# EAGLE design HB-UNI-Sen-RFID-RC_V1.0 (EAGLE 9.4.2)
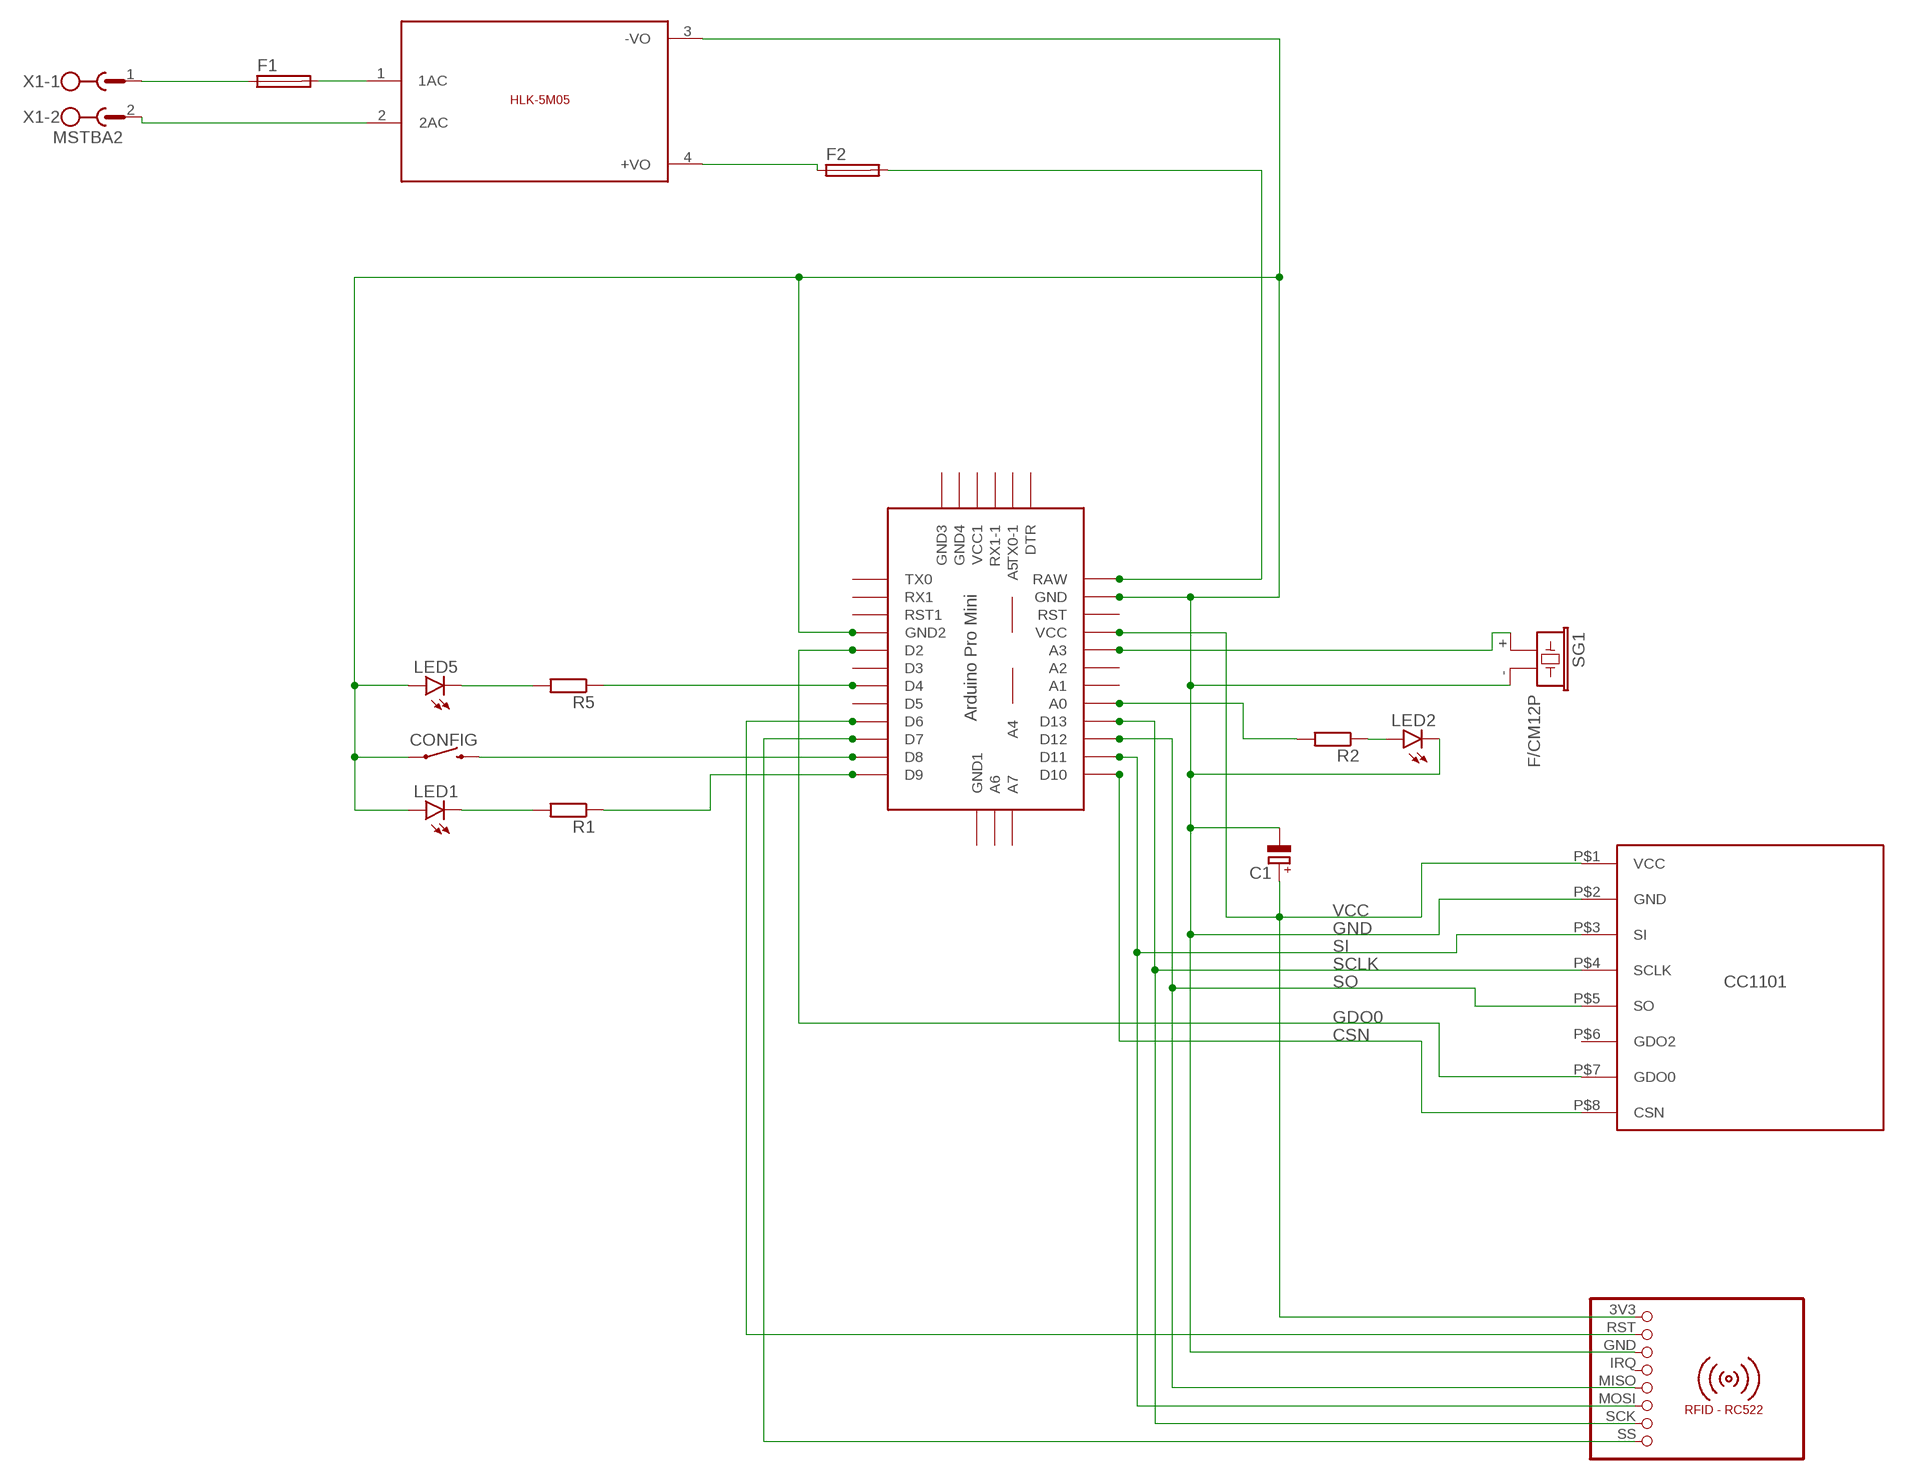
[diagram p0: schematic, sheet 1]

## Parts
C1  CPOL-EUE2.5-5  [E2,5-5]
CONFIG  MOMENTARY-SWITCH-SPST-PTH-6.0MM-KIT  [TACTILE_SWITCH_PTH_6.0MM_KIT]
F1  SH22,5A  [SH22,5A]
F2  SH22,5A  [SH22,5A]
LED1  LED3MM  [LED3MM]
LED2  LED3MM  [LED3MM]
LED5  LED3MM  [LED3MM]
M1  RFID-RC522  [RFID-RC522]
R1  R-EU_0309/10  [0309/10]
R2  R-EU_0309/10  [0309/10]
R5  R-EU_0309/10  [0309/10]
SG1  F/CM12P  [F/CM12P]
U$1  CC1101  [CC1101]
U$2  ABK-PRO-MINI  [ABK-PRO-MINI]
U$3  5VDC/5W  HLK-5M05  [HLK-5M05]
X1  MSTBA2  [MSTBA2]

## Nets
CSN: U$1.P$8(CSN) U$2.D10
GDO0: U$1.P$7(GDO0) U$2.D2
GND: C1.- CONFIG.1 LED1.A LED2.K(C) LED5.A M1.GND SG1.- U$1.P$2(GND) U$2.GND U$2.GND1(GND2) U$3.3(-VO)
N$1: M1.SS U$2.D7
N$2: M1.RST U$2.D6
N$3: LED1.K(C) R1.2
N$4: R1.1 U$2.D9
N$5: SG1.+ U$2.A3
N$7: LED2.A R2.1
N$8: R2.2 U$2.A0
N$9: F1.1 X1.1
N$10: F2.1 U$3.4(+VO)
N$11: U$3.2(2AC) X1.2
N$16: CONFIG.3 U$2.D8
N$17: R5.1 U$2.D4
N$18: LED5.K(C) R5.2
N$19: F1.2 U$3.1(1AC)
N$24: F2.2 U$2.RAW
SCLK: M1.SCK U$1.P$4(SCLK) U$2.D13
SI: M1.MOSI U$1.P$3(SI) U$2.D11
SO: M1.MISO U$1.P$5(SO) U$2.D12
VCC: C1.+ M1.3V3 U$1.P$1(VCC) U$2.VCC
Unconnected: M1.IRQ U$1.P$6(GDO2) U$2.A1 U$2.A2 U$2.A4 U$2.A5 U$2.A6 U$2.A7 U$2.D3 U$2.D5 U$2.DTR U$2.GND2(GND3) U$2.GND3(GND4) U$2.GND4(GND1) U$2.RST U$2.RST1 U$2.RX1 U$2.RX1-1 U$2.TX0 U$2.TX0-1 U$2.VCC1

## Library data of the parts
C1 = resistor:CPOL-EU: POLARIZED CAPACITOR, European symbol
CONFIG = SparkFun-Switches:MOMENTARY-SWITCH-SPST: Momentary Switch (Pushbutton) - SPST Normally-open (NO) SPST momentary switches (buttons, pushbuttons). Variants PTH-12MM - 12mm square, through-hole Momentary Pushbutton Switch - 12mm Square <https://www.sparkfun.com/products/9190> (COM-09190) PTH-6.0MM, PTH-6.0MM-KIT - 6.0mm square, through-hole Mini Pushbutton Switch <https://www.sparkfun.com/products/97> (COM-00097) KIT package intended for soldering kit's - only one side of pads' copper is exposed. PTH-RIGHT-ANGLE-KIT - Right-angle, through-hole Right Angle Tactile Button <https://www.sparkfun.com/products/10791> - Used on SparkFun BigTime Watch Kit <https://www.sparkfun.com/products/11734> SMD-12MM - 12mm square, surface-mount Tactile Button - SMD (12mm) <https://www.sparkfun.com/products/12993> (COM-12993) Used on SparkFun PicoBoard <https://www.sparkfun.com/products/11888> SMD-4.5MM - 4.5mm Square Trackball Switch Used on SparkFun Blackberry Trackballer Breakout <https://www.sparkfun.com/products/13169> SMD-4.6MMX2.8MM - 4.60mm x 2.80mm, surface mount Used on SparkFun SAMD21 Mini Breakout <https://www.sparkfun.com/products/13664> SMD-5.2MM, SMD-5.2-REDUNDANT - 5.2mm square, surface-mount Mini Pushbutton Switch - SMD <https://www.sparkfun.com/products/8720> (COM-08720) Used on Arduino Pro Mini <https://www.sparkfun.com/products/11114> REDUNDANT package connects both switch circuits together SMD-6.0X3.5MM - 6.0 x 3.5mm, surface mount Momentary Reset Switch SMD <https://www.sparkfun.com/products/8229> (COM-08229) SMD-6.2MM-TALL - 6.2mm square, surface mount Tactile Button - SMD (6mm) <https://www.sparkfun.com/products/12992> Used on SparkFun Digital Sandbox <https://www.sparkfun.com/products/12651> SMD-RIGHT-ANGLE - Right-angle, surface mount Used on SparkFun Block for Intel® Edison - Arduino <https://www.sparkfun.com/products/13036>; PROD_ID: SWCH-08441; SF_SKU: COM-00097
F1 F2 = fuse:SH22,5A: FUSE HOLDER grid 22,5mm, isolated cap OGN0031 8201, Schurter (Buerklin); MPN: 0031.7701.11; OC_FARNELL: unknown; OC_NEWARK: 04F1224
LED1 LED2 LED5 = led:LED: LED OSRAM: - CHIPLED LG R971, LG N971, LY N971, LG Q971, LY Q971, LO R971, LY R971 LH N974, LH R974 LS Q976, LO Q976, LY Q976 LO Q996 - Hyper CHIPLED LW Q18S LB Q993, LB Q99A, LB R99A - SideLED LS A670, LO A670, LY A670, LG A670, LP A670 LB A673, LV A673, LT A673, LW A673 LH A674 LY A675 LS A676, LA A676, LO A676, LY A676, LW A676 LS A679, LY A679, LG A679 - Hyper Micro SIDELED® LS Y876, LA Y876, LO Y876, LY Y876 LT Y87S - SmartLED LW L88C, LW L88S LB L89C, LB L89S, LG L890 LS L89K, LO L89K, LY L89K LS L896, LA L896, LO L896, LY L896 - TOPLED LS T670, LO T670, LY T670, LG T670, LP T670 LSG T670, LSP T670, LSY T670, LOP T670, LYG T670 LG T671, LOG T671, LSG T671 LB T673, LV T673, LT T673, LW T673 LH T674 LS T676, LA T676, LO T676, LY T676, LB T676, LH T676, LSB T676, LW T676 LB T67C, LV T67C, LT T67C, LS T67K, LO T67K, LY T67K, LW E67C LS E67B, LA E67B, LO E67B, LY E67B, LB E67C, LV E67C, LT E67C LW T67C LS T679, LY T679, LG T679 LS T770, LO T770, LY T770, LG T770, LP T770 LB T773, LV T773, LT T773, LW T773 LH T774 LS E675, LA E675, LY E675, LS T675 LS T776, LA T776, LO T776, LY T776, LB T776 LHGB T686 LT T68C, LB T68C - Hyper Mini TOPLED® LB M676 - Mini TOPLED Santana® LG M470 LS M47K, LO M47K, LY M47K Source: http://www.osram.convergy.de LUXEON: - LUMILED® LXK2-PW12-R00, LXK2-PW12-S00, LXK2-PW14-U00, LXK2-PW14-V00 LXK2-PM12-R00, LXK2-PM12-S00, LXK2-PM14-U00 LXK2-PE12-Q00, LXK2-PE12-R00, LXK2-PE12-S00, LXK2-PE14-T00, LXK2-PE14-U00 LXK2-PB12-K00, LXK2-PB12-L00, LXK2-PB12-M00, LXK2-PB14-N00, LXK2-PB14-P00, LXK2-PB14-Q00 LXK2-PR12-L00, LXK2-PR12-M00, LXK2-PR14-Q00, LXK2-PR14-R00 LXK2-PD12-Q00, LXK2-PD12-R00, LXK2-PD12-S00 LXK2-PH12-R00, LXK2-PH12-S00 LXK2-PL12-P00, LXK2-PL12-Q00, LXK2-PL12-R00 Source: www.luxeon.com KINGBRIGHT: KA-3528ASYC Source: www.kingbright.com
M1 = mfrc522-module:RFID-RC522: RFID-RC522 MFRC-522 based breakout board
R1 R2 R5 = resistor:R-EU_: RESISTOR, European symbol
SG1 = buzzer:F/CM12P: BUZZER Source: Buerklin; OC_FARNELL: unknown; OC_NEWARK: unknown
U$1 = kevin:CC1101
U$2 = Arduino-clone:ABK-PRO-MINI: ABK Pro-Mini Arduino Clone
U$3 = HLK-5M05:HLK-5M05: HLK-5M05 is an 5Volt/5W smps developed by HI-LINK; SIZE: 23x38(mm)
X1 = con-phoenix-508:MSTBA2: PHOENIX; MF: FARNELL; MPN: 1757242; OC_FARNELL: 3705171; OC_NEWARK: 71C4161

## Board
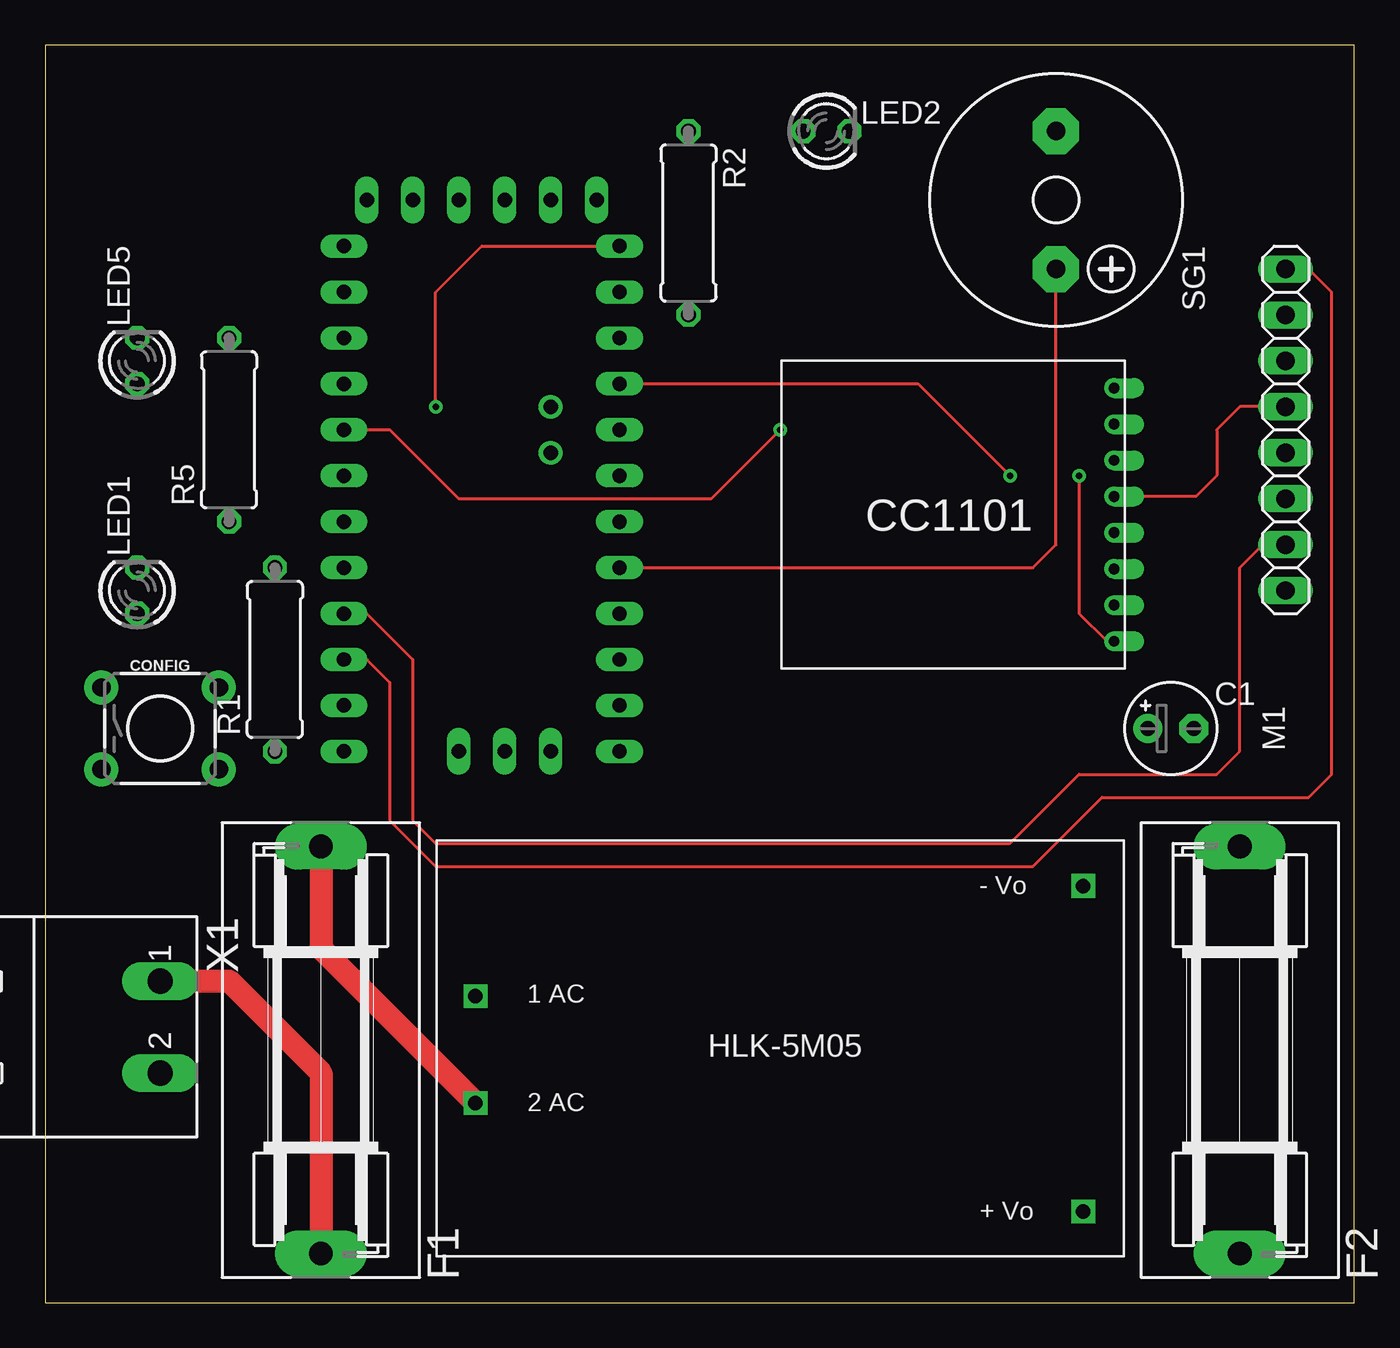
[diagram p1: board, top side]
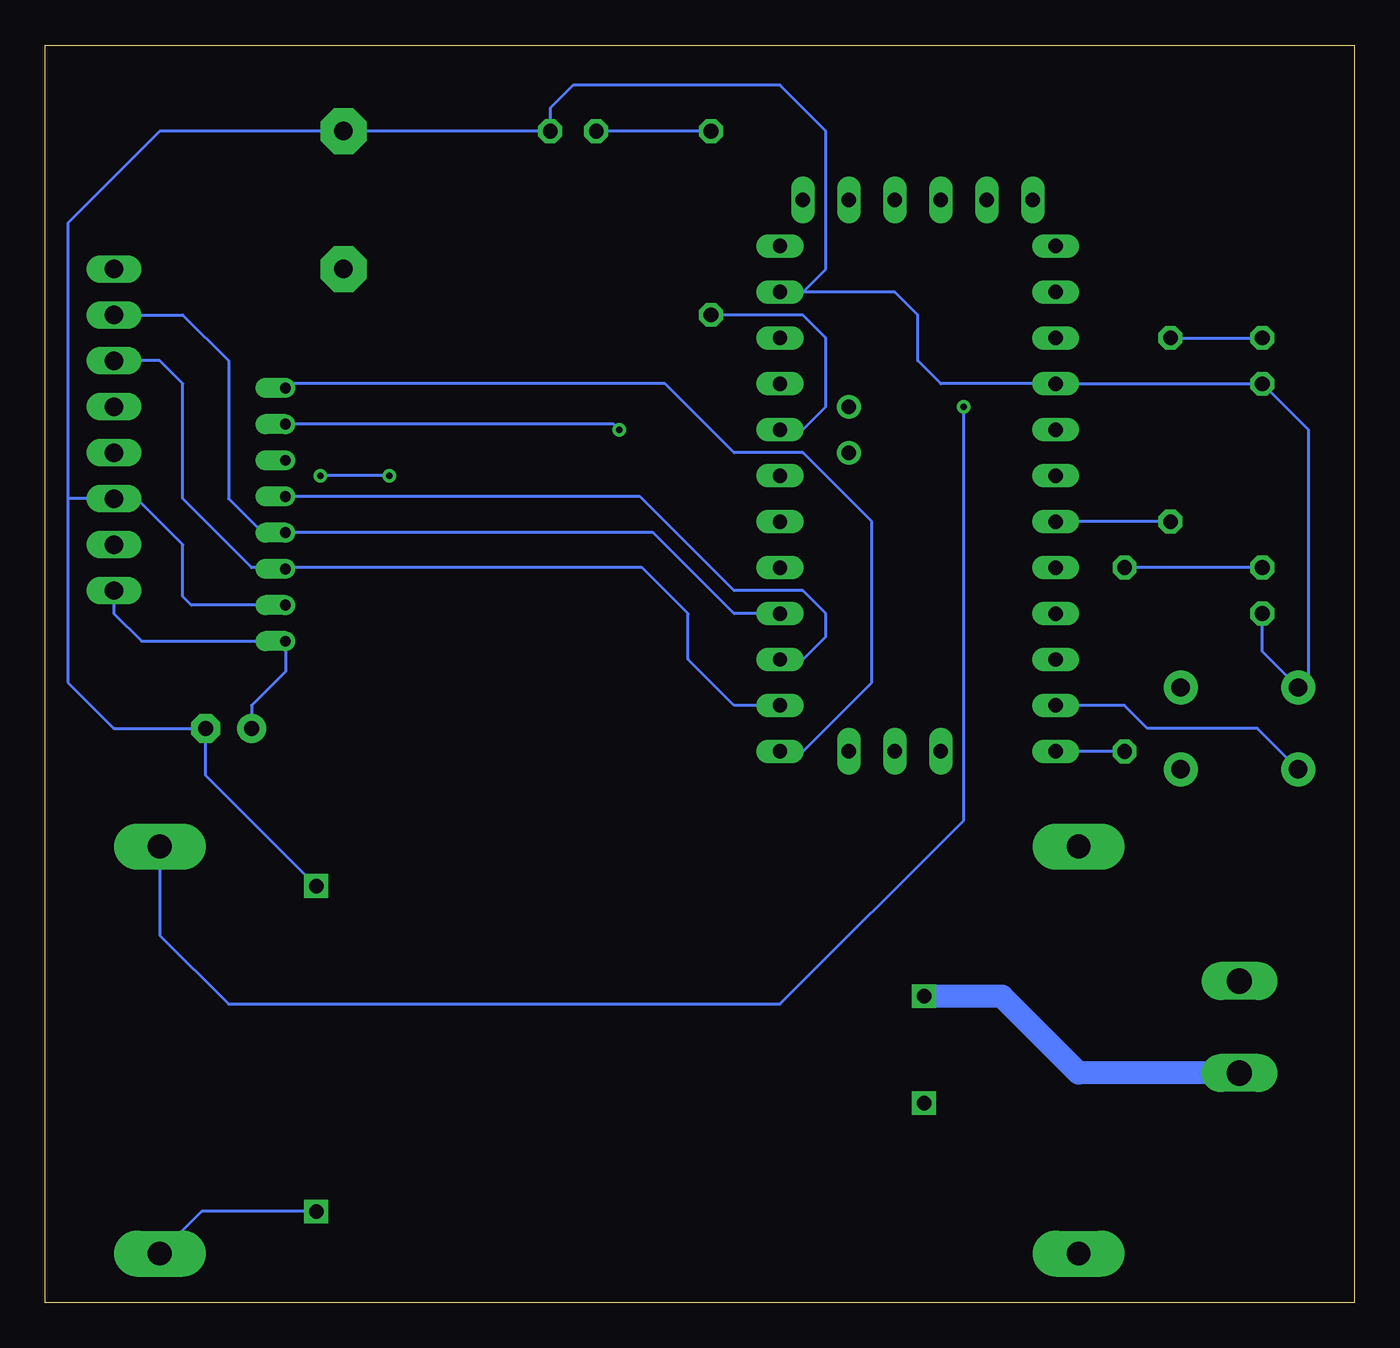
[diagram p2: board, bottom side, seen from below]

Size 72.37 x 69.52 mm. Coordinates in mm from the lower left corner, seen from the top.
Outline: 0,0 72.37,0 72.37,69.52 0,69.52 0,0
Copper layers (1*16): Top 0.035mm / dielectric 1.5mm / Bottom 0.035mm
Design rules "default": minimum track width 6mil, minimum drill 0.35mm, track to track 6mil, track to pad 6mil, pad to pad 6mil, via to via 6mil, smd to smd 6mil, copper to edge 40mil, drill to drill 6mil, minimum pad ring 10mil, minimum via ring 8mil, stop-mask expansion 4mil, vias tented up to drill 0mil, thermal gap 10mil

### Footprints (pad centres in the part's own frame; a part is rotated, then mirrored left to right if it is on the bottom)
E2,5-5 = drill 0.813 pad 1.6: + -1.27,0 | drill 0.813 pad 1.6 octagon: - 1.27,0
TACTILE_SWITCH_PTH_6.0MM_KIT = drill 1.016 pad 1.88: 1 -3.251,2.261; 2 3.251,2.261; 3 -3.251,-2.261; 4 3.251,-2.261
SH22,5A = drill 1.321 pad 2.54 long: 1 -11.252,0; 2 11.252,0
LED3MM = drill 0.813 octagon: A -1.27,0; K 1.27,0
RFID-RC522 = drill 1.016 long: 3V3 -8.89,0; GND -3.81,0; IRQ -1.27,0; MISO 1.27,0; MOSI 3.81,0; RST -6.35,0; SCK 6.35,0; SS 8.89,0
0309/10 = drill 0.813 octagon: 1 -5.08,0; 2 5.08,0
F/CM12P = drill 1.016 pad 2.54 octagon: + 3.81,0; - -3.81,0
CC1101 = drill 0.6 offset: P$1 0.6,15.5; P$2 0.6,13.5; P$3 0.6,11.5; P$4 0.6,9.5; P$5 0.6,7.5; P$6 0.6,5.5; P$7 0.6,3.5; P$8 0.6,1.5
ABK-PRO-MINI = drill 0.8 long: A0 10.16,-3.81; A1 10.16,-6.35; A2 10.16,-8.89; A3 10.16,-11.43; A6 3.81,-21.59; A7 6.35,-21.59; D2 -5.08,-3.81; D3 -5.08,-6.35; D4 -5.08,-8.89; D5 -5.08,-11.43; D6 -5.08,-13.97; D7 -5.08,-16.51; D8 -5.08,-19.05; D9 -5.08,-21.59; D10 10.16,-21.59; D11 10.16,-19.05; D12 10.16,-16.51; D13 10.16,-13.97; DTR 8.89,8.89; GND 10.16,3.81; GND1 -5.08,-1.27; GND2 -3.81,8.89; GND3 -1.27,8.89; GND4 1.27,-21.59; RAW 10.16,6.35; RST 10.16,1.27; RST1 -5.08,1.27; RX1 -5.08,3.81; RX1-1 3.81,8.89; TX0 -5.08,6.35; TX0-1 6.35,8.89; VCC 10.16,-1.27; VCC1 1.27,8.89 | drill 0.8: A4 6.35,-5.08; A5 6.35,-2.54
HLK-5M05 = drill 0.8 square: 1 -16.85,-2.93; 2 -16.85,2.97; 3 16.75,9.07; 4 16.75,-8.93
MSTBA2 = drill 1.397 long: 1 -2.54,5.08; 2 2.54,5.08

### Placement (x,y rotation side)
C1  62.23,31.75 0 top
CONFIG  6.35,31.75 0 top
F1  15.24,13.97 90 top
F2  66.04,13.97 90 top
LED1  5.08,39.37 90 top
LED2  43.18,64.77 0 top
LED5  5.08,52.07 90 top
M1  68.58,48.26 90 top
R1  12.7,35.56 90 top
R2  35.56,59.69 270 top
R5  10.16,48.26 90 top
SG1  55.88,60.96 270 top
U$1  59.69,52.07 180 top
U$2  21.59,52.07 0 top
U$3  40.64,13.97 0 top
X1  1.27,15.24 270 top

### Tracks (layer width: path | path; a pad name or v marks a point on that pad's centre or on a via)
CSN
  Bottom 0.152: U$2.D10 30.48,30.48 26.67,34.29 26.67,43.18 30.48,46.99 34.29,46.99 38.1,50.8 58.86,50.8 U$1.P$8
GDO0  (via drill 0.35)
  Top 0.152: U$2.D2 19.05,48.26 22.86,44.45 36.83,44.45 v40.64,48.26
  Bottom 0.152: v40.64,48.26 40.95,48.57 U$1.P$7
GND
  Bottom 0.152: U$1.P$2 64.3,38.57 64.77,39.04 64.77,41.91 67.31,44.45 M1.GND 71.12,44.45 | 71.12,44.45 71.12,34.29 68.58,31.75 C1.- 63.5,29.15 U$3.3 | 71.12,44.45 71.12,59.69 66.04,64.77 SG1.- LED2.K 44.45,66.04 43.18,67.31 31.75,67.31 29.21,64.77 29.21,57.15 30.48,55.88 U$2.GND 25.4,55.88 24.13,54.61 24.13,52.07 22.86,50.8 U$2.GND1 LED5.A 2.54,48.26 2.54,34.57 CONFIG.1 5.08,35.99 LED1.A
N$1
  Top 0.152: U$2.D7 17.78,35.56 19.05,34.29 19.05,26.67 21.59,24.13 54.61,24.13 58.42,27.94 69.85,27.94 71.12,29.21 71.12,55.88 69.85,57.15 M1.SS
N$2
  Top 0.152: U$2.D6 17.78,38.1 20.32,35.56 20.32,26.67 21.59,25.4 53.34,25.4 57.15,29.21 64.77,29.21 66.04,30.48 66.04,40.64 67.31,41.91 M1.RST
N$3
  Bottom 0.152: LED1.K R1.2
N$4
  Bottom 0.152: R1.1 U$2.D9
N$5
  Top 0.152: SG1.+ 55.88,41.91 54.61,40.64 U$2.A3
N$7
  Bottom 0.152: R2.1 LED2.A
N$8
  Bottom 0.152: U$2.A0 30.48,48.26 29.21,49.53 29.21,53.34 30.48,54.61 R2.2
N$9
  Top 1.27: X1.1 10.16,17.78 15.24,12.7 F1.1
N$10
  Bottom 0.152: U$3.4 63.72,5.04 F2.1
N$11
  Bottom 1.27: X1.2 15.24,12.7 19.48,16.94 U$3.2
N$16
  Bottom 0.152: CONFIG.3 5.36,31.75 11.43,31.75 12.7,33.02 U$2.D8
N$17
  Bottom 0.152: R5.1 U$2.D4
N$18
  Bottom 0.152: R5.2 LED5.K
N$19
  Top 1.27: U$3.1 15.24,19.59 F1.2
N$24  (via drill 0.35)
  Top 0.152: v21.59,49.53 21.59,55.88 24.13,58.42 U$2.RAW
  Bottom 0.152: F2.2 66.04,20.32 62.23,16.51 31.75,16.51 21.59,26.67 v21.59,49.53
SCLK
  Bottom 0.152: M1.SCK 64.77,54.61 62.23,52.07 62.23,44.45 60.35,42.57 59.69,42.57 U$1.P$4 38.76,42.57 34.29,38.1 U$2.D13
SI
  Bottom 0.152: U$1.P$3 59.16,40.64 | 59.16,40.64 60.96,40.64 64.77,44.45 64.77,50.8 66.04,52.07 M1.MOSI | U$2.D11 34.29,33.02 36.83,35.56 36.83,38.1 39.37,40.64 59.16,40.64
SO
  Top 0.152: M1.MISO 66.04,49.53 64.77,48.26 64.77,45.72 63.62,44.57 U$1.P$5
  Bottom 0.152: U$2.D12 30.48,35.56 29.21,36.83 29.21,38.1 30.48,39.37 34.29,39.37 39.49,44.57 U$1.P$5
VCC  (via drill 0.35)
  Top 0.152: U$2.VCC 48.26,50.8 v53.34,45.72 | v57.15,45.72 57.15,38.1 58.68,36.57 U$1.P$1
  Bottom 0.152: M1.3V3 68.58,38.1 67.05,36.57 U$1.P$1 59.09,34.89 60.96,33.02 C1.+ | v53.34,45.72 v57.15,45.72